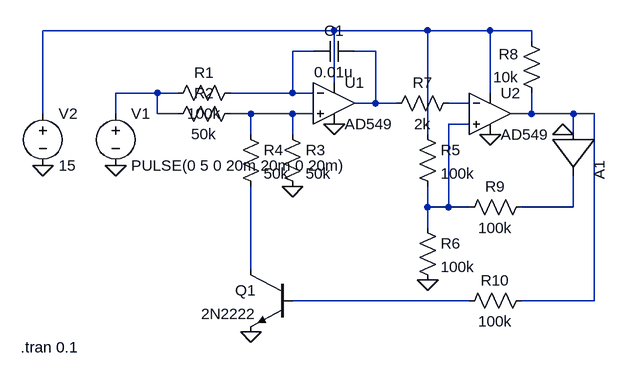
[diagram p0: schematic VoltagetoFrequency.asc]
VoltagetoFrequency.asc, the LTspice schematic file:
Version 4
SHEET 1 880 744
WIRE 96 32 -352 32
WIRE 240 32 96 32
WIRE 336 32 240 32
WIRE 400 32 336 32
WIRE 400 48 400 32
WIRE 64 64 32 64
WIRE 160 64 128 64
WIRE 96 112 96 32
WIRE -176 128 -240 128
WIRE -144 128 -176 128
WIRE 32 128 32 64
WIRE 32 128 -64 128
WIRE 64 128 32 128
WIRE 336 128 336 32
WIRE 160 144 160 64
WIRE 160 144 128 144
WIRE 192 144 160 144
WIRE 304 144 272 144
WIRE -352 160 -352 32
WIRE -240 160 -240 128
WIRE -176 160 -176 128
WIRE -144 160 -176 160
WIRE -32 160 -64 160
WIRE 32 160 -32 160
WIRE 64 160 32 160
WIRE 400 160 400 128
WIRE 400 160 368 160
WIRE 464 160 400 160
WIRE 496 160 464 160
WIRE 304 176 272 176
WIRE -32 192 -32 160
WIRE 32 192 32 160
WIRE 240 192 240 32
WIRE 464 192 464 160
WIRE 240 304 240 272
WIRE 272 304 272 176
WIRE 272 304 240 304
WIRE 304 304 272 304
WIRE 464 304 464 256
WIRE 464 304 384 304
WIRE 240 336 240 304
WIRE -32 400 -32 272
WIRE 304 448 32 448
WIRE 496 448 496 160
WIRE 496 448 384 448
FLAG 32 272 0
FLAG 240 416 0
FLAG -32 496 0
FLAG 448 192 0
FLAG 336 192 0
FLAG 96 176 0
FLAG -240 240 0
FLAG -352 240 0
SYMBOL Opamps\\AD549 96 80 R0
SYMATTR InstName U1
SYMBOL Opamps\\AD549 336 96 R0
SYMATTR InstName U2
SYMBOL res -48 112 R90
WINDOW 0 0 56 VBottom 2
WINDOW 3 32 56 VTop 2
SYMATTR InstName R1
SYMATTR Value 100k
SYMBOL res -48 144 R90
WINDOW 0 0 56 VBottom 2
WINDOW 3 32 56 VTop 2
SYMATTR InstName R2
SYMATTR Value 50k
SYMBOL res 16 176 R0
SYMATTR InstName R3
SYMATTR Value 50k
SYMBOL res -48 176 R0
SYMATTR InstName R4
SYMATTR Value 50k
SYMBOL npn 32 400 M0
SYMATTR InstName Q1
SYMATTR Value 2N2222
SYMBOL Digital\\buf1 528 192 R90
SYMATTR InstName A1
SYMBOL res 224 176 R0
SYMATTR InstName R5
SYMATTR Value 100k
SYMBOL res 224 320 R0
SYMATTR InstName R6
SYMATTR Value 100k
SYMBOL res 288 128 R90
WINDOW 0 0 56 VBottom 2
WINDOW 3 32 56 VTop 2
SYMATTR InstName R7
SYMATTR Value 2k
SYMBOL res 416 144 R180
WINDOW 0 36 76 Left 2
WINDOW 3 36 40 Left 2
SYMATTR InstName R8
SYMATTR Value 10k
SYMBOL res 400 288 R90
WINDOW 0 0 56 VBottom 2
WINDOW 3 32 56 VTop 2
SYMATTR InstName R9
SYMATTR Value 100k
SYMBOL cap 128 48 R90
WINDOW 0 0 32 VBottom 2
WINDOW 3 32 32 VTop 2
SYMATTR InstName C1
SYMATTR Value 0.01u
SYMBOL res 400 432 R90
WINDOW 0 0 56 VBottom 2
WINDOW 3 32 56 VTop 2
SYMATTR InstName R10
SYMATTR Value 100k
SYMBOL voltage -240 144 R0
WINDOW 123 0 0 Left 0
WINDOW 39 0 0 Left 0
SYMATTR InstName V1
SYMATTR Value PULSE(0 5 0 20m 20m 0 20m)
SYMBOL voltage -352 144 R0
WINDOW 123 0 0 Left 0
WINDOW 39 0 0 Left 0
SYMATTR InstName V2
SYMATTR Value 15
TEXT -386 520 Left 2 !.tran 0.1

The netlist it stands for:
* VoltagetoFrequency.asc
XU1 N006 N002 N001 0 N003 AD549  ; pins In+ In- V+ V- OUT
XU2 N008 N005 N001 0 N007 AD549  ; pins In+ In- V+ V- OUT
R1 N002 N004 100k
R2 N006 N004 50k
R3 N006 0 50k
R4 N006 N010 50k
Q1 N010 N011 0 0 2N2222
A1 N007 0 0 0 0 0 N009 0 BUF
R5 N001 N008 100k
R6 N008 0 100k
R7 N005 N003 2k
R8 N007 N001 10k
R9 N009 N008 100k
C1 N003 N002 0.01u
R10 N007 N011 100k
V1 N004 0 PULSE(0 5 0 20m 20m 0 20m)
V2 N001 0 15
.model NPN NPN
.model PNP PNP
.lib standard.bjt
.tran 0.1
.backanno
.end